# EAGLE schematic Boardv! (EAGLE 6.5.0)
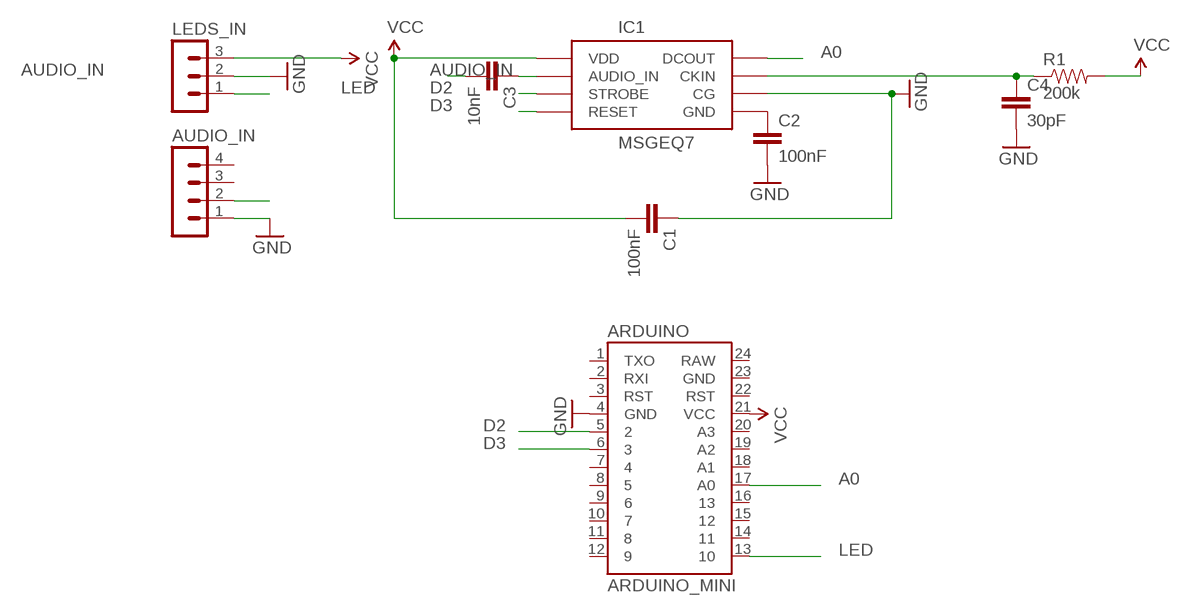
[diagram p0: schematic, sheet 1]

## Parts
ARDUINO  ARDUINO_MINI  [ARDUINO_MINI]
AUDIO_IN  MA04-1  [MA04-1]
C1  100nF  0.1UF-50V-20%(PTH)KIT-EZ  [CAP-PTH-SMALL-KIT]
C2  100nF  0.1UF-50V-20%(PTH)KIT-EZ  [CAP-PTH-SMALL-KIT]
C3  10nF  0.1UF-50V-20%(PTH)KIT-EZ  [CAP-PTH-SMALL-KIT]
C4  30pF  0.1UF-50V-20%(PTH)KIT-EZ  [CAP-PTH-SMALL-KIT]
IC1  MSGEQ7DIL  [DIL-08]
LEDS_IN  MA03-1  [MA03-1]
R1  200k  10KOHM1/6W5%(PTH)KIT  [AXIAL-0.3-KIT]

## Nets
A0: ARDUINO.17(A0) IC1.3(DCOUT)
AUDIO_IN: AUDIO_IN.2 C3.2
D2: ARDUINO.5 IC1.4(STROBE)
D3: ARDUINO.6 IC1.7(RESET)
GND: ARDUINO.4(GND) AUDIO_IN.1 C1.1 C2.2 C4.2 IC1.6(CG) LEDS_IN.2
LED: ARDUINO.13 LEDS_IN.1
N$1: C2.1 IC1.2(GND)
N$2: C4.1 IC1.8(CKIN) R1.P$1
N$3: C3.1 IC1.5(AUDIO_IN)
VCC: ARDUINO.21(VCC) C1.2 IC1.1(VDD) LEDS_IN.3 R1.P$2
Unconnected: ARDUINO.1(TXO) ARDUINO.2(RXI) ARDUINO.3(RST) ARDUINO.7 ARDUINO.8 ARDUINO.9 ARDUINO.10 ARDUINO.11 ARDUINO.12 ARDUINO.14 ARDUINO.15 ARDUINO.16 ARDUINO.18(A1) ARDUINO.19(A2) ARDUINO.20(A3) ARDUINO.22(RST) ARDUINO.23(GND) ARDUINO.24(RAW) AUDIO_IN.3 AUDIO_IN.4

## Library data of the parts
ARDUINO = SparkFun-Boards:ARDUINO_MINI: Arduino Pro Mini footprint
AUDIO_IN = con-lstb:MA04-1: PIN HEADER; OC_FARNELL: unknown; OC_NEWARK: unknown
C1-C4 = SparkFun-Capacitors:0.1UF-50V-20%(PTH): CAP-08370; PROD_ID: CAP-08370
IC1 = SparkFun-AnalogIC:MSGEQ7: 7-band graphic equalizer
LEDS_IN = con-lstb:MA03-1: PIN HEADER; OC_FARNELL: unknown; OC_NEWARK: unknown
R1 = SparkFun-Resistors:10KOHM1/6W5%(PTH): RES-08375; PROD_ID: RES-08375